# Altium schematic sheet devices.SchDoc
size A4
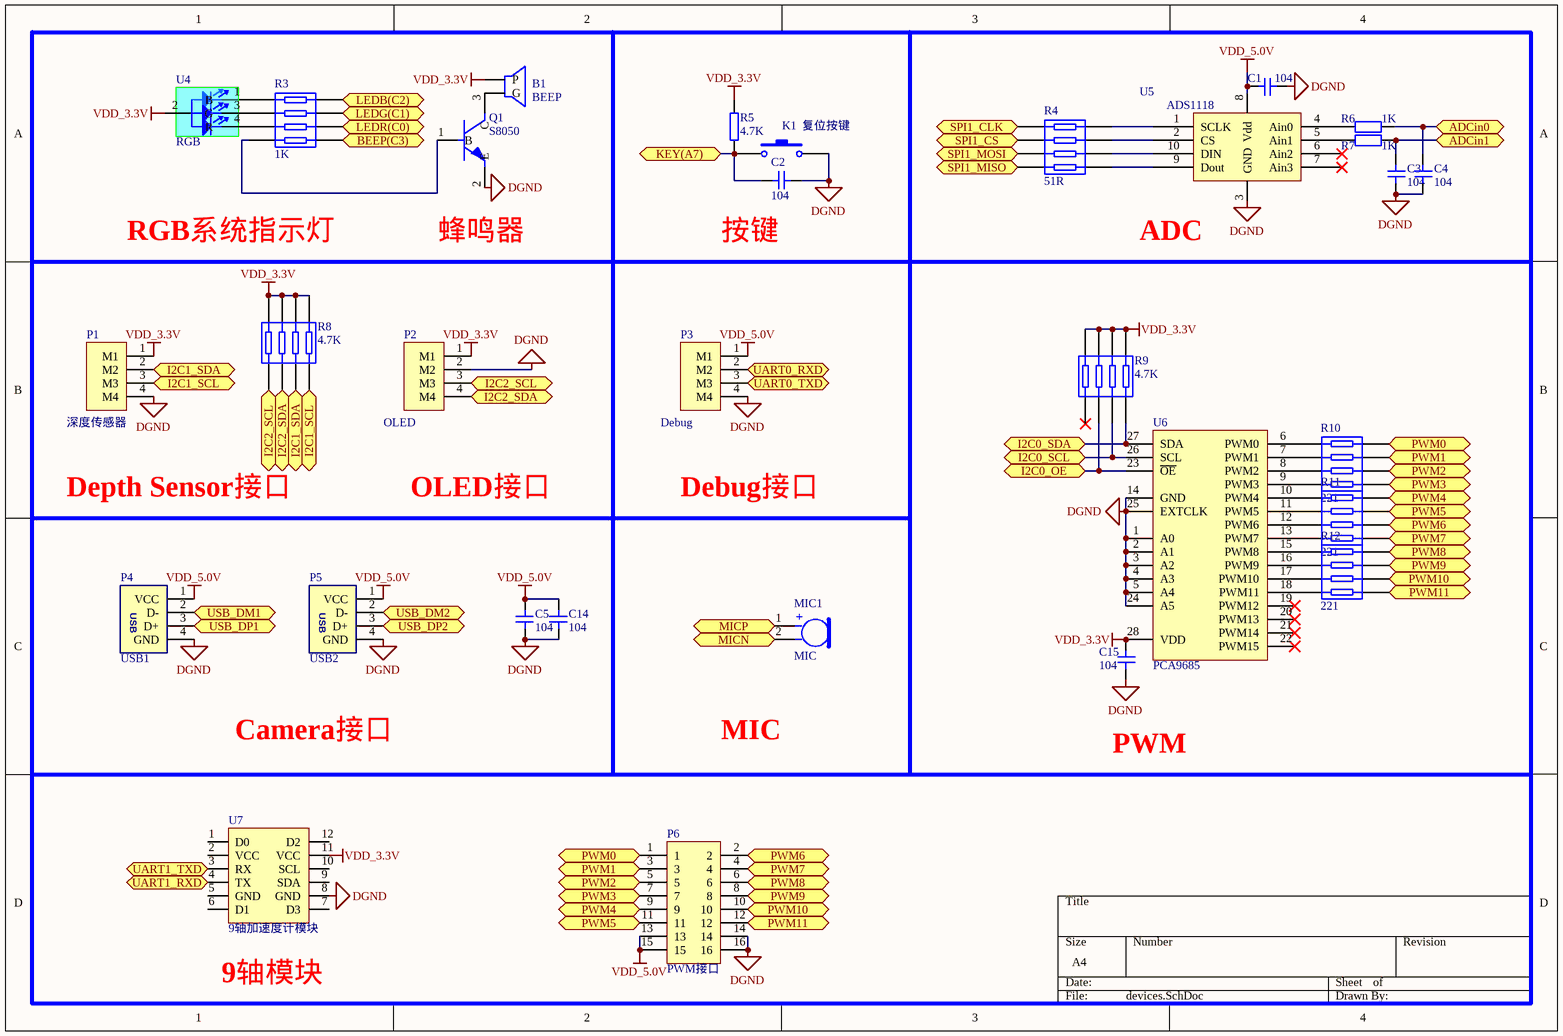
[diagram p0: devices.SchDoc]

## Parts
B1  BEEP  [BUZZER]
C1  104  [0805C]
C2  104  [0805C]
C3  104  [0805C]
C4  104  [0805C]
C5  104  [0805C]
C14  104  [0805C]
C15  104  [0805C]
K1  复位按键  [贴片按键]
MIC1  MIC  [MIC]
P1  深度传感器  [MX1.25S-4P]
P2  OLED  [MX1.25S-4P]
P3  Debug  [MX1.25S-4P]
P4  USB1  [PH2.0S-4P]
P5  USB2  [PH2.0S-4P]
P6  PWM接口  [HDR2X8/2.54-SMD]
Q1  S8050  [SOT-23]
R3  1K  [排阻(4位贴片)]
R4  51R  [排阻(4位贴片)]
R5  4.7K  [0805R]
R6  1K  [0805R]
R7  1K  [0805R]
R8  4.7K  [排阻(4位贴片)]
R9  4.7K  [排阻(4位贴片)]
R10  221  [排阻(4位贴片)]
R11  221  [排阻(4位贴片)]
R12  221  [排阻(4位贴片)]
U4  RGB  [RGB-3528]
U5  ADS1118  [VSSOP-10]
U6  PCA9685  [TSSOP-28]
U7  9轴加速度计模块  [9轴加速度计]

## Ports
ADCin0, ADCin1, BEEP(C3), I2C0_OE, I2C0_SCL, I2C0_SDA, I2C1_SCL, I2C1_SDA, I2C2_SCL, I2C2_SDA, KEY(A7), LEDB(C2), LEDG(C1), LEDR(C0), MICN, MICP, PWM0, PWM0 (out), PWM1, PWM2, PWM3, PWM4, PWM5, PWM6, PWM7, PWM8, PWM9, PWM10, PWM11, SPI1_CLK, SPI1_CS, SPI1_MISO, SPI1_MOSI, UART0_RXD, UART0_TXD, UART1_RXD, UART1_TXD, USB_DM1, USB_DM2, USB_DP1, USB_DP2

## Nets
DGND: C1.2 C2.1 C3.1 C4.1 C5.2 C14.2 C15.1 K1.2 P1.4(M4) P2.2(M2) P3.4(M4) P4.4(GND) P5.4(GND) P6.14 P6.16 Q1.2(E) U5.3(GND) U6.1(A0) U6.2(A1) U6.3(A2) U6.4(A3) U6.5(A4) U6.14(GND) U6.24(A5) U6.25(EXTCLK) U7.8(GND)
VDD_3.3V: B1.1(P) C15.2 P1.1(M1) P2.1(M1) R5.2 R8.2 R8.4 R8.6 R8.8 R9.2 R9.4 R9.6 R9.8 U4.2 U6.28(VDD) U7.11(VCC)
VDD_5.0V: C1.1 C5.1 C14.1 P3.1(M1) P4.1(VCC) P5.1(VCC) P6.13 P6.15 U5.8(Vdd)
ADCin0: C4.2 R6.2 ; port ADCin0
ADCin1: C3.2 R7.2 ; port ADCin1
BEEP(C3): R3.7 ; port BEEP(C3)
I2C0_OE: R9.5 U6.23(~{OE}) ; port I2C0_OE
I2C0_SCL: R9.3 U6.26(SCL) ; port I2C0_SCL
I2C0_SDA: R9.1 U6.27(SDA) ; port I2C0_SDA
I2C1_SCL: P1.3(M3) R8.7 ; port I2C1_SCL
I2C1_SDA: P1.2(M2) R8.5 ; port I2C1_SDA
I2C2_SCL: P2.3(M3) R8.1 ; port I2C2_SCL
I2C2_SDA: P2.4(M4) R8.3 ; port I2C2_SDA
KEY(A7): C2.2 K1.1 R5.1 ; port KEY(A7)
LEDB(C2): R3.1 ; port LEDB(C2)
LEDG(C1): R3.3 ; port LEDG(C1)
LEDR(C0): R3.5 ; port LEDR(C0)
MICN: MIC1.2(N) ; port MICN
MICP: MIC1.1(P) ; port MICP
PWM0: P6.1 R10.8 ; port PWM0
PWM1: P6.3 R10.6 ; port PWM1
PWM2: P6.5 R10.4 ; port PWM2
PWM3: P6.7 R10.2 ; port PWM3
PWM4: P6.9 R11.8 ; port PWM4
PWM5: P6.11 R11.6 ; port PWM5
PWM6: P6.2 R11.4 ; port PWM6
PWM7: P6.4 R11.2 ; port PWM7
PWM8: P6.6 R12.8 ; port PWM8
PWM9: P6.8 R12.6 ; port PWM9
PWM10: P6.10 R12.4 ; port PWM10
PWM11: P6.12 R12.2 ; port PWM11
SPI1_CLK: R4.2 ; port SPI1_CLK
SPI1_CS: R4.4 ; port SPI1_CS
SPI1_MISO: R4.8 ; port SPI1_MISO
SPI1_MOSI: R4.6 ; port SPI1_MOSI
UART0_RXD: P3.2(M2) ; port UART0_RXD
UART0_TXD: P3.3(M3) ; port UART0_TXD
UART1_RXD: U7.4(TX) ; port UART1_RXD
UART1_TXD: U7.3(RX) ; port UART1_TXD
USB_DM1: P4.2(D-) ; port USB_DM1
USB_DM2: P5.2(D-) ; port USB_DM2
USB_DP1: P4.3(D+) ; port USB_DP1
USB_DP2: P5.3(D+) ; port USB_DP2
NetB1_2: B1.2(G) Q1.3(C)
NetQ1_1: Q1.1(B) R3.8
NetR3_2: R3.2 U4.1(B)
NetR3_4: R3.4 U4.3(G)
NetR3_6: R3.6 U4.4(R)
NetR4_1: R4.1 U5.1(SCLK)
NetR4_3: R4.3 U5.2(CS)
NetR4_5: R4.5 U5.10(DIN)
NetR4_7: R4.7 U5.9(Dout)
NetR6_1: R6.1 U5.4(Ain0)
NetR7_1: R7.1 U5.5(Ain1)
NetR10_1: R10.1 U6.9(PWM3)
NetR10_3: R10.3 U6.8(PWM2)
NetR10_5: R10.5 U6.7(PWM1)
NetR10_7: R10.7 U6.6(PWM0)
NetR11_1: R11.1 U6.13(PWM7)
NetR11_3: R11.3 U6.12(PWM6)
NetR11_5: R11.5 U6.11(PWM5)
NetR11_7: R11.7 U6.10(PWM4)
NetR12_1: R12.1 U6.18(PWM11)
NetR12_3: R12.3 U6.17(PWM10)
NetR12_5: R12.5 U6.16(PWM9)
NetR12_7: R12.7 U6.15(PWM8)

Not connected (* = marked no-connect by the designer): R9 7*; U5 6(Ain2)* 7(Ain3)*; U6 19(PWM12)* 20(PWM13)* 21(PWM14)* 22(PWM15)*; U7 1(D0) 2(VCC) 5(GND) 6(D1) 7(D3) 9(SDA) 10(SCL) 12(D2)

## Notes on the sheet
- RGB系统指示灯
- (near Q1) 蜂鸣器
- 按键
- (near U5) ADC
- Depth Sensor接口
- OLED接口
- Debug接口
- Camera接口
- MIC
- PWM
- (near U7) 9轴模块
- (in symbol MIC) +

## Library data of the parts
C1-C5 C14 C15 = Cap1: 无极贴片电容
K1 = 贴片按键: 轻触开关
P1-P3 = 接线端子-4PIN: 4PIN
P4 P5 = USB
P6 = Header 2X8
Q1 = NPN: NPN三极管
R3 R4 R8-R12 = Res-4: 排阻
R5-R7 = Res: 电阻
U7 = 9轴加速度计